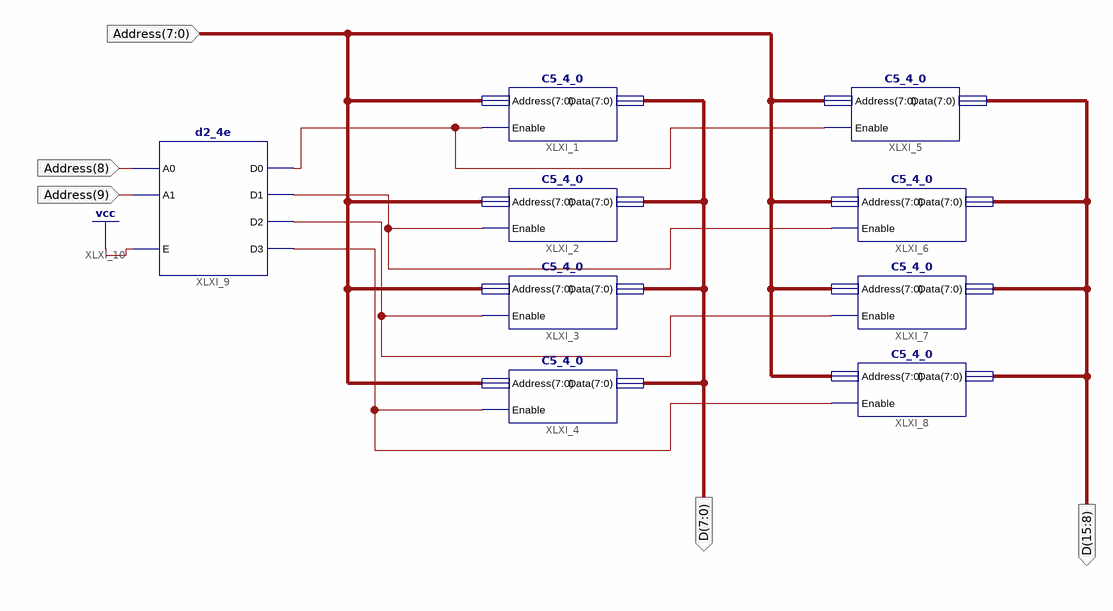
[diagram p0: schematic sheet 1]
// Xilinx ISE schematic C5_4_1.sch (kintex7) as structural Verilog: 9 symbols, 5 ports
module C5_4_1 (
  input  [9:0] Address,
  output [15:0] D
);

  wire XLXN_23, XLXN_24, XLXN_25, XLXN_26;

  C5_4_0 XLXI_1 (.Address(Address[7:0]), .Enable(XLXN_23), .Data(D[7:0]));
  C5_4_0 XLXI_2 (.Address(Address[7:0]), .Enable(XLXN_24), .Data(D[7:0]));
  C5_4_0 XLXI_3 (.Address(Address[7:0]), .Enable(XLXN_25), .Data(D[7:0]));
  C5_4_0 XLXI_4 (.Address(Address[7:0]), .Enable(XLXN_26), .Data(D[7:0]));
  C5_4_0 XLXI_5 (.Address(Address[7:0]), .Enable(XLXN_23), .Data(D[15:8]));
  C5_4_0 XLXI_6 (.Address(Address[7:0]), .Enable(XLXN_24), .Data(D[15:8]));
  C5_4_0 XLXI_7 (.Address(Address[7:0]), .Enable(XLXN_25), .Data(D[15:8]));
  C5_4_0 XLXI_8 (.Address(Address[7:0]), .Enable(XLXN_26), .Data(D[15:8]));
  d2_4e XLXI_9 (.A0(Address[8]), .A1(Address[9]), .E(1'b1), .D0(XLXN_23), .D1(XLXN_24), .D2(XLXN_25), .D3(XLXN_26));
endmodule
